# EAGLE design le_strum (EAGLE 9.6.2)
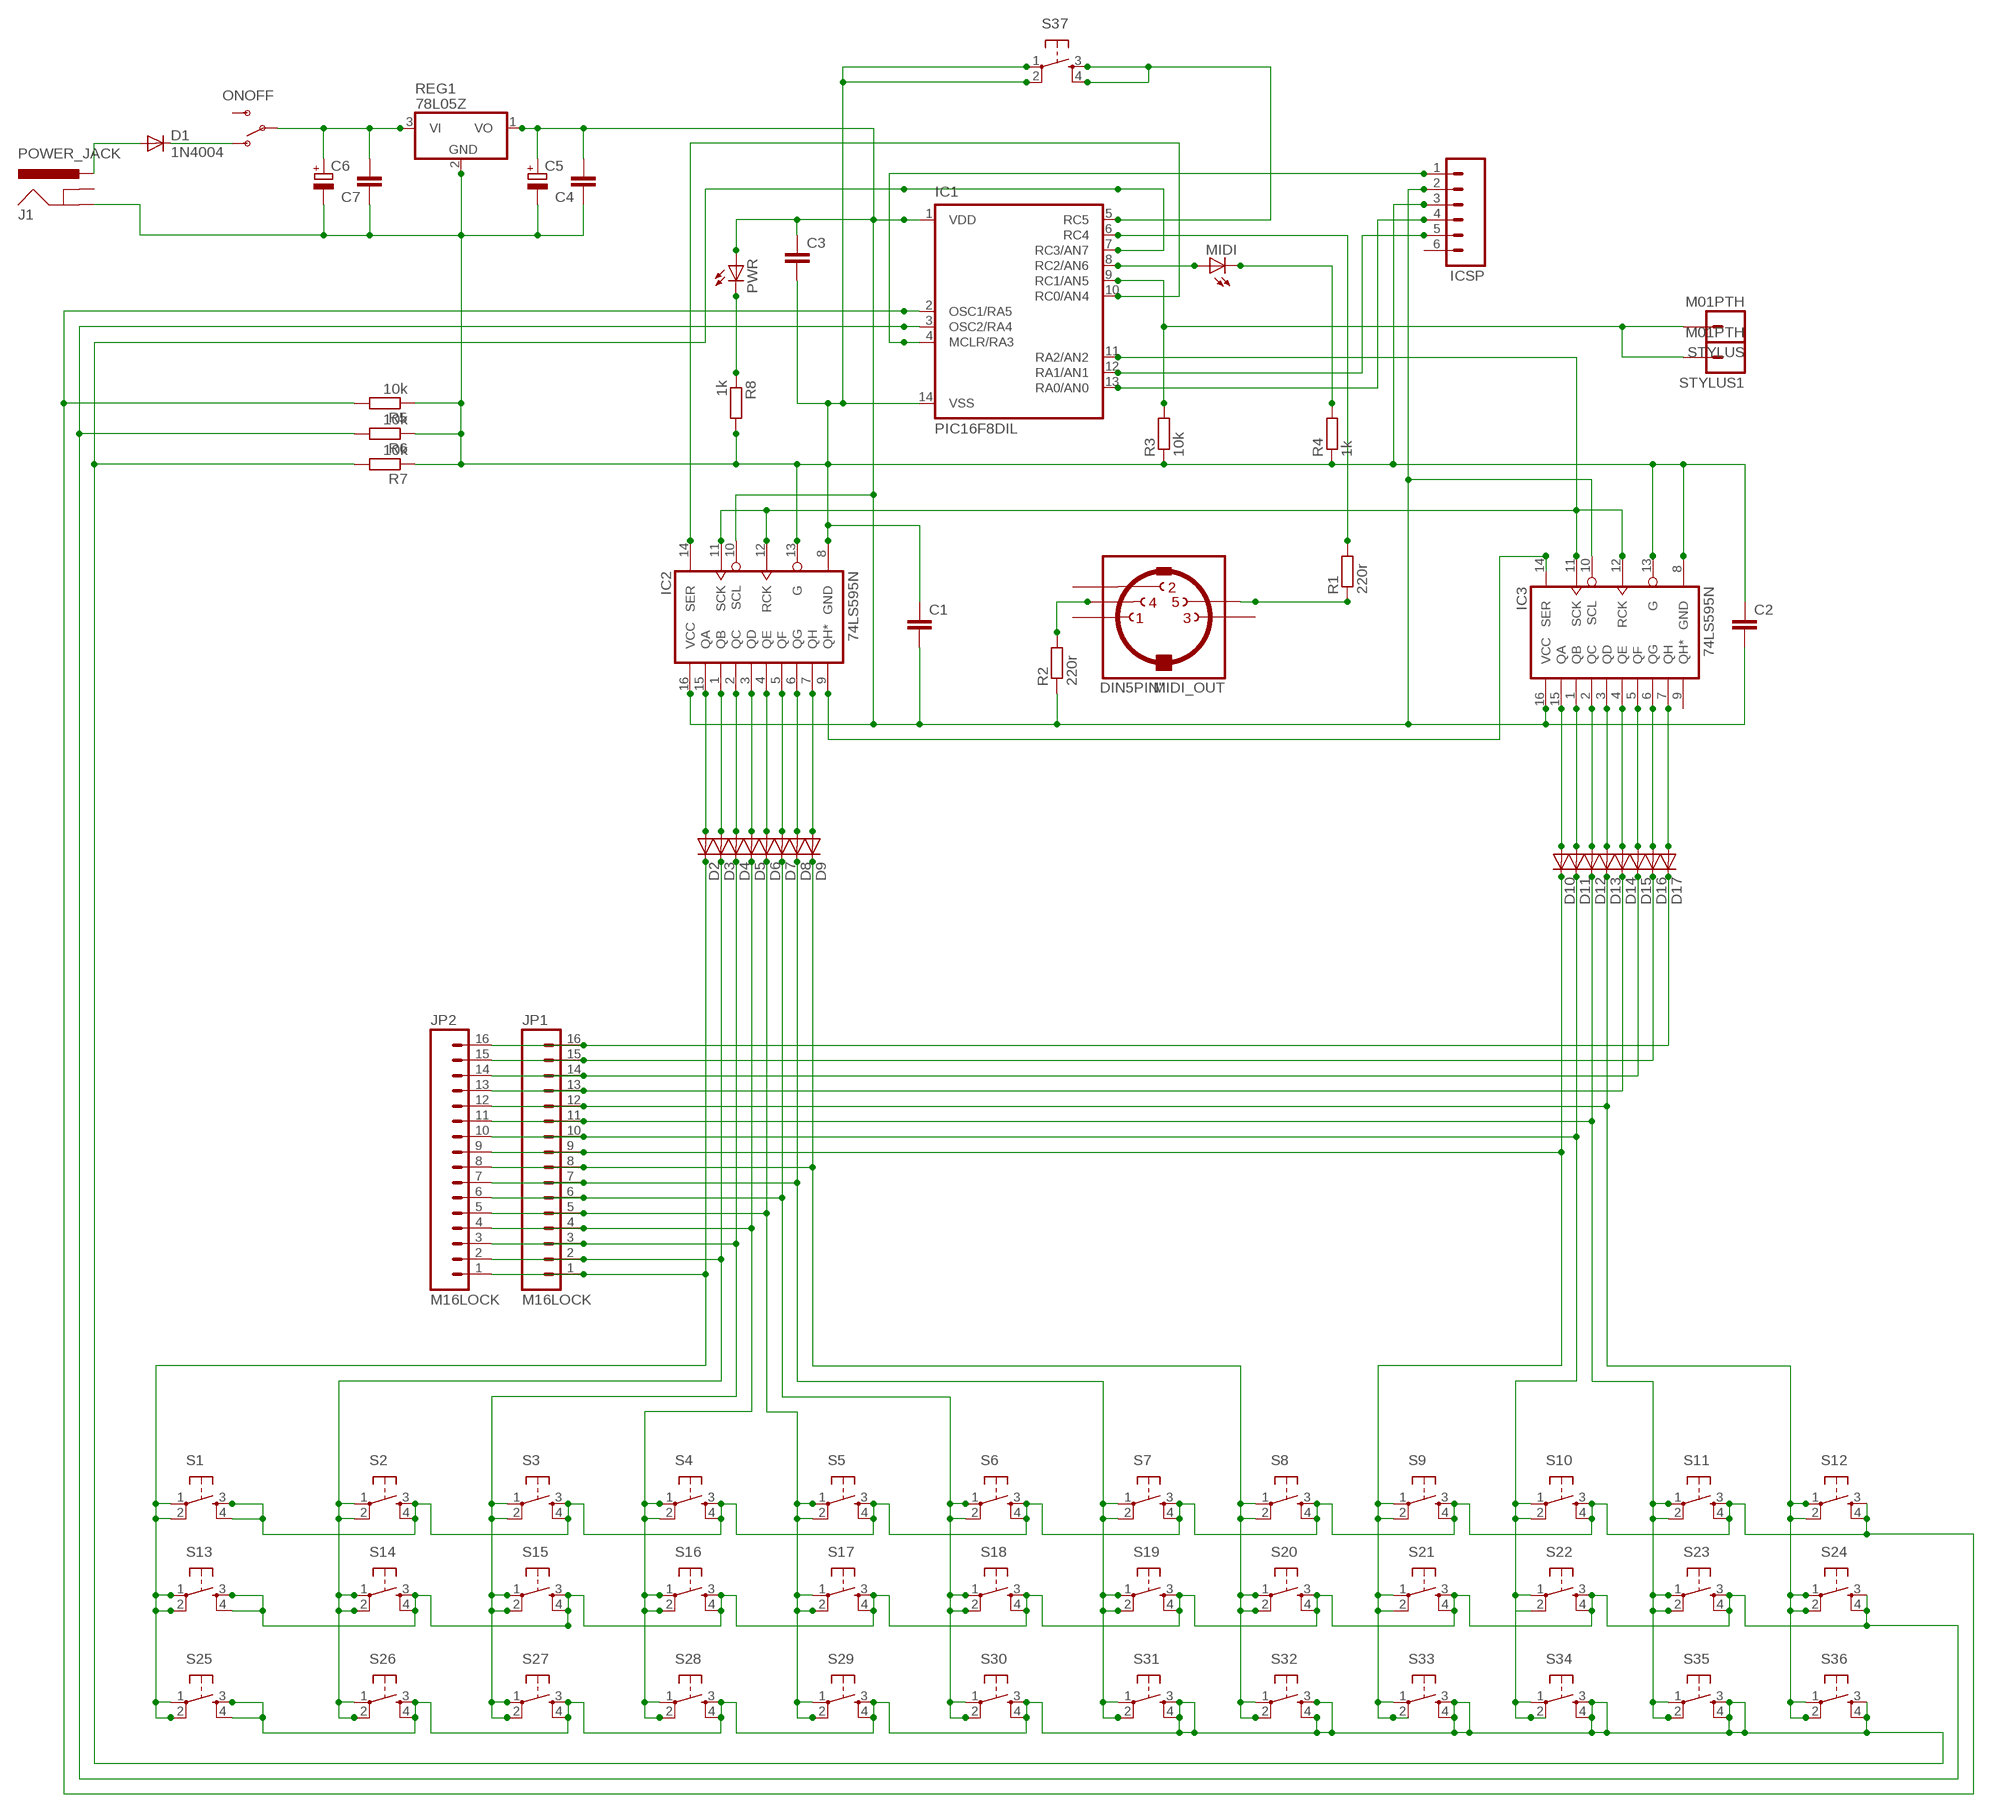
[diagram p0: schematic, sheet 1]

## Parts
C1  C-EU025-024X044  [C025-024X044]
C2  C-EU025-024X044  [C025-024X044]
C3  C-EU025-024X044  [C025-024X044]
C4  C-EU025-024X044  [C025-024X044]
C5  CPOL-EUE2-5  [E2-5]
C6  CPOL-EUE2-5  [E2-5]
C7  C-EU025-024X044  [C025-024X044]
D1  1N4004  [DO41-10]
D2  DIODE-D-5  [D-5]
D3  DIODE-D-5  [D-5]
D4  DIODE-D-5  [D-5]
D5  DIODE-D-5  [D-5]
D6  DIODE-D-5  [D-5]
D7  DIODE-D-5  [D-5]
D8  DIODE-D-5  [D-5]
D9  DIODE-D-5  [D-5]
D10  DIODE-D-5  [D-5]
D11  DIODE-D-5  [D-5]
D12  DIODE-D-5  [D-5]
D13  DIODE-D-5  [D-5]
D14  DIODE-D-5  [D-5]
D15  DIODE-D-5  [D-5]
D16  DIODE-D-5  [D-5]
D17  DIODE-D-5  [D-5]
IC1  PIC16F8DIL  [DIL14]
IC2  74LS595N  [DIL16]
IC3  74LS595N  [DIL16]
ICSP  M06SIP  [1X06]
J1  POWER_JACK  [POWER_JACK_PTH]
JP1  M16LOCK  [1X16_LOCK]
JP2  M16LOCK  [1X16_LOCK]
MIDI  LED3MM  [LED3MM]
MIDI_OUT  DIN5PIN"  [TRUCONN90]
ONOFF  SWITCH-SPSTPTH  [SWITCH-SPDT]
PWR  LED3MM  [LED3MM]
R1  220r  R-EU_0207/7  [0207/7]
R2  220r  R-EU_0207/7  [0207/7]
R3  10k  R-EU_0207/7  [0207/7]
R4  1k  R-EU_0207/7  [0207/7]
R5  10k  R-EU_0207/7  [0207/7]
R6  10k  R-EU_0207/7  [0207/7]
R7  10k  R-EU_0207/7  [0207/7]
R8  1k  R-EU_0207/7  [0207/7]
REG1  78L05Z  [TO92]
S1  TAC_SWITCHPTH  [TACTILE-PTH]
S2  TAC_SWITCHPTH  [TACTILE-PTH]
S3  TAC_SWITCHPTH  [TACTILE-PTH]
S4  TAC_SWITCHPTH  [TACTILE-PTH]
S5  TAC_SWITCHPTH  [TACTILE-PTH]
S6  TAC_SWITCHPTH  [TACTILE-PTH]
S7  TAC_SWITCHPTH  [TACTILE-PTH]
S8  TAC_SWITCHPTH  [TACTILE-PTH]
S9  TAC_SWITCHPTH  [TACTILE-PTH]
S10  TAC_SWITCHPTH  [TACTILE-PTH]
S11  TAC_SWITCHPTH  [TACTILE-PTH]
S12  TAC_SWITCHPTH  [TACTILE-PTH]
S13  TAC_SWITCHPTH  [TACTILE-PTH]
S14  TAC_SWITCHPTH  [TACTILE-PTH]
S15  TAC_SWITCHPTH  [TACTILE-PTH]
S16  TAC_SWITCHPTH  [TACTILE-PTH]
S17  TAC_SWITCHPTH  [TACTILE-PTH]
S18  TAC_SWITCHPTH  [TACTILE-PTH]
S19  TAC_SWITCHPTH  [TACTILE-PTH]
S20  TAC_SWITCHPTH  [TACTILE-PTH]
S21  TAC_SWITCHPTH  [TACTILE-PTH]
S22  TAC_SWITCHPTH  [TACTILE-PTH]
S23  TAC_SWITCHPTH  [TACTILE-PTH]
S24  TAC_SWITCHPTH  [TACTILE-PTH]
S25  TAC_SWITCHPTH  [TACTILE-PTH]
S26  TAC_SWITCHPTH  [TACTILE-PTH]
S27  TAC_SWITCHPTH  [TACTILE-PTH]
S28  TAC_SWITCHPTH  [TACTILE-PTH]
S29  TAC_SWITCHPTH  [TACTILE-PTH]
S30  TAC_SWITCHPTH  [TACTILE-PTH]
S31  TAC_SWITCHPTH  [TACTILE-PTH]
S32  TAC_SWITCHPTH  [TACTILE-PTH]
S33  TAC_SWITCHPTH  [TACTILE-PTH]
S34  TAC_SWITCHPTH  [TACTILE-PTH]
S35  TAC_SWITCHPTH  [TACTILE-PTH]
S36  TAC_SWITCHPTH  [TACTILE-PTH]
S37  TAC_SWITCHPTH  [TACTILE-PTH]
STYLUS  M01PTH  [1X01]
STYLUS1  M01PTH  [1X01]

## Nets
CARRY: IC2.9(QH*) IC3.14(SER)
CLK: IC1.11(RA2/AN2) IC2.11(SCK) IC2.12(RCK) IC3.11(SCK) IC3.12(RCK)
GND: C1.1 C2.1 C3.2 C4.1 C5.- C6.- C7.1 IC1.14(VSS) IC2.8(GND) IC2.13(G) IC3.8(GND) IC3.13(G) ICSP.3 J1.GND R3.1 R4.1 R5.1 R6.1 R7.1 R8.2 REG1.2(GND) S37.1 S37.2
LINE1: D2.C JP1.1 JP2.1 S1.1 S1.2 S13.1 S13.2 S25.1 S25.2
LINE2: D3.C JP1.2 JP2.2 S2.1 S2.2 S14.1 S14.2 S26.1 S26.2
LINE3: D4.C JP1.3 JP2.3 S3.1 S3.2 S15.1 S15.2 S27.1 S27.2
LINE4: D5.C JP1.4 JP2.4 S4.1 S4.2 S16.1 S16.2 S28.1 S28.2
LINE5: D6.C JP1.5 JP2.5 S5.1 S5.2 S17.1 S17.2 S29.1 S29.2
LINE6: D7.C JP1.6 JP2.6 S6.1 S6.2 S18.1 S18.2 S30.1 S30.2
LINE7: D8.C JP1.7 JP2.7 S7.1 S7.2 S19.1 S19.2 S31.1 S31.2
LINE8: D9.C JP1.8 JP2.8 S8.1 S8.2 S20.1 S20.2 S32.1 S32.2
LINE9: D10.C JP1.9 JP2.9 S9.1 S9.2 S21.1 S21.2 S33.1 S33.2
LINE10: D11.C JP1.10 JP2.10 S10.1 S10.2 S22.1 S22.2 S34.1 S34.2
LINE11: D12.C JP1.11 JP2.11 S11.1 S11.2 S23.1 S23.2 S35.1 S35.2
LINE12: D13.C JP1.12 JP2.12 S12.1 S12.2 S24.1 S24.2 S36.1 S36.2
LINE13: D14.C JP1.13 JP2.13
LINE14: D15.C JP1.14 JP2.14
LINE15: D16.C JP1.15 JP2.15
LINE16: D17.C JP1.16 JP2.16
N$1: IC1.2(OSC1/RA5) R5.2 S1.3 S1.4 S2.3 S2.4 S3.3 S3.4 S4.3 S4.4 S5.3 S5.4 S6.3 S6.4 S7.3 S7.4 S8.3 S8.4 S9.3 S9.4 S10.3 S10.4 S11.3 S11.4 S12.3 S12.4
N$2: D1.A J1.PWR
N$3: D1.C ONOFF.1(O)
N$4: IC1.13(RA0/AN0) ICSP.4
N$5: D2.A IC2.15(QA)
N$6: D3.A IC2.1(QB)
N$7: D4.A IC2.2(QC)
N$8: D5.A IC2.3(QD)
N$9: D6.A IC2.4(QE)
N$10: D7.A IC2.5(QF)
N$11: D8.A IC2.6(QG)
N$12: IC1.9(RC1/AN5) R3.2 STYLUS1.1 STYLUS.1
N$13: D9.A IC2.7(QH)
N$14: D10.A IC3.15(QA)
N$15: D11.A IC3.1(QB)
N$16: D12.A IC3.2(QC)
N$17: D13.A IC3.3(QD)
N$18: D14.A IC3.4(QE)
N$19: D15.A IC3.5(QF)
N$20: D16.A IC3.6(QG)
N$21: D17.A IC3.7(QH)
N$22: IC1.5(RC5) S37.3 S37.4
N$23: IC1.7(RC3/AN7) R7.2 S25.3 S25.4 S26.3 S26.4 S27.3 S27.4 S28.3 S28.4 S29.3 S29.4 S30.3 S30.4 S31.3 S31.4 S32.3 S32.4 S33.3 S33.4 S34.3 S34.4 S35.3 S35.4 S36.3 S36.4
N$34: IC1.10(RC0/AN4) IC2.14(SER)
N$35: IC1.4(MCLR/RA3) ICSP.1
N$38: IC1.8(RC2/AN6) MIDI.A
N$42: IC1.12(RA1/AN1) ICSP.5
N$44: MIDI_OUT.5 R1.1
N$46: IC1.6(RC4) R1.2
N$48: MIDI_OUT.4 R2.2
N$50: IC1.3(OSC2/RA4) R6.2 S13.3 S13.4 S14.3 S14.4 S15.3 S15.4 S16.3 S16.4 S17.3 S17.4 S18.3 S18.4 S19.3 S19.4 S20.3 S20.4 S21.3 S21.4 S22.3 S22.4 S23.3 S23.4 S24.3 S24.4
N$52: MIDI.K(C) R4.2
N$54: PWR.K(C) R8.1
N$59: C6.+ C7.2 ONOFF.2(P) REG1.3(VI)
VCC: C1.2 C2.2 C3.1 C4.2 C5.+ IC1.1(VDD) IC2.10(SCL) IC2.16(VCC) IC3.10(SCL) IC3.16(VCC) ICSP.2 PWR.A R2.1 REG1.1(VO)
Unconnected: IC3.9(QH*) ICSP.6 J1.GNDBREAK MIDI_OUT.1 MIDI_OUT.2 MIDI_OUT.3 ONOFF.3(S)

## Library data of the parts
C1-C4 C7 = rcl:C-EU: CAPACITOR, European symbol
C5 C6 = rcl:CPOL-EU: POLARIZED CAPACITOR, European symbol
D1 = diode:1N4004: DIODE general purpose rectifier, 1 A
D2-D17 = diode:DIODE-: DIODE
IC1 = pic16f6xx_14pin:PIC16F8*: MICROCONTROLLER 14-Pin, 8-Bit PIC16F8X Family - CMOS Flash Pin Compatible : 16F630, 16F676, 16F684, 16F688 Keywords: PIC16F630, PIC16F676, PIC16F684, PIC16F688
IC2 IC3 = SparkFun:74*595: 8-bit SHIFT REGISTER, output latch
ICSP = SparkFun:M06: Header 6 Standard 6-pin 0.1" header. Use with straight break away headers (SKU : PRT-00116), right angle break away headers (PRT-00553), swiss pins (PRT-00743), machine pins (PRT-00117), and female headers (PRT-00115). Molex polarized connector foot print use with SKU : PRT-08094 with associated crimp pins and housings. NOTES ON THE VARIANTS LOCK and LOCK_LONGPADS... This footprint was designed to help hold the alignment of a through-hole component (i.e. 6-pin header) while soldering it into place. You may notice that each hole has been shifted either up or down by 0.005 of an inch from it's more standard position (which is a perfectly straight line). This slight alteration caused the pins (the squares in the middle) to touch the edges of the holes. Because they are alternating, it causes a "brace" to hold the component in place. 0.005 has proven to be the perfect amount of "off-center" position when using our standard breakaway headers. Although looks a little odd when you look at the bare footprint, once you have a header in there, the alteration is very hard to notice. Also, if you push a header all the way into place, it is covered up entirely on the bottom side. This idea of altering the position of holes to aid alignment will be further integrated into the Sparkfun Library for other footprints. It can help hold any component with 3 or more connection pins.
J1 = SparkFun-Connectors:POWER_JACK: Power Jack Connector This is the standard 5.5mm barrel jack for power. The PTH is the most common, proven, reliable, footprint. The Slot footprint only works if the mill layer is transmitted to the PCB fab house so be warned. Here are the connectors we sell at SparkFun: DC Barrel Power Jack/Connector <https://www.sparkfun.com/products/119> (PRT-00119) DC Barrel Power Jack/Connector (SMD) <https://www.sparkfun.com/products/12748> (PRT-12748) DC Barrel Jack Adapter - Breadboard Compatible <https://www.sparkfun.com/products/10811> (PRT-10811) It is used on this SparkFun product (and many, many others): SparkFun RedBoard - Programmed with Arduino <https://www.sparkfun.com/products/12757> (DEV-12757) Also, if you need a mating power supply or connector, please check these out: Wall Adapter Power Supply - 9VDC 650mA <https://www.sparkfun.com/products/298> (TOL-00298) DC Barrel Jack Adapter - Male <https://www.sparkfun.com/products/10287> (PRT-10287); PROD_ID: CONN-08197
JP1 JP2 = SparkFun:M16
MIDI PWR = led:LED: LED OSRAM: - CHIPLED LG R971, LG N971, LY N971, LG Q971, LY Q971, LO R971, LY R971 LH N974, LH R974 LS Q976, LO Q976, LY Q976 LO Q996 - Hyper CHIPLED LW Q18S LB Q993, LB Q99A, LB R99A - SideLED LS A670, LO A670, LY A670, LG A670, LP A670 LB A673, LV A673, LT A673, LW A673 LH A674 LY A675 LS A676, LA A676, LO A676, LY A676, LW A676 LS A679, LY A679, LG A679 - Hyper Micro SIDELED® LS Y876, LA Y876, LO Y876, LY Y876 LT Y87S - SmartLED LW L88C, LW L88S LB L89C, LB L89S, LG L890 LS L89K, LO L89K, LY L89K LS L896, LA L896, LO L896, LY L896 - TOPLED LS T670, LO T670, LY T670, LG T670, LP T670 LSG T670, LSP T670, LSY T670, LOP T670, LYG T670 LG T671, LOG T671, LSG T671 LB T673, LV T673, LT T673, LW T673 LH T674 LS T676, LA T676, LO T676, LY T676, LB T676, LH T676, LSB T676, LW T676 LB T67C, LV T67C, LT T67C, LS T67K, LO T67K, LY T67K, LW E67C LS E67B, LA E67B, LO E67B, LY E67B, LB E67C, LV E67C, LT E67C LW T67C LS T679, LY T679, LG T679 LS T770, LO T770, LY T770, LG T770, LP T770 LB T773, LV T773, LT T773, LW T773 LH T774 LS E675, LA E675, LY E675, LS T675 LS T776, LA T776, LO T776, LY T776, LB T776 LHGB T686 LT T68C, LB T68C - Hyper Mini TOPLED® LB M676 - Mini TOPLED Santana® LG M470 LS M47K, LO M47K, LY M47K Source: http://www.osram.convergy.de LUXEON: - LUMILED® LXK2-PW12-R00, LXK2-PW12-S00, LXK2-PW14-U00, LXK2-PW14-V00 LXK2-PM12-R00, LXK2-PM12-S00, LXK2-PM14-U00 LXK2-PE12-Q00, LXK2-PE12-R00, LXK2-PE12-S00, LXK2-PE14-T00, LXK2-PE14-U00 LXK2-PB12-K00, LXK2-PB12-L00, LXK2-PB12-M00, LXK2-PB14-N00, LXK2-PB14-P00, LXK2-PB14-Q00 LXK2-PR12-L00, LXK2-PR12-M00, LXK2-PR14-Q00, LXK2-PR14-R00 LXK2-PD12-Q00, LXK2-PD12-R00, LXK2-PD12-S00 LXK2-PH12-R00, LXK2-PH12-S00 LXK2-PL12-P00, LXK2-PL12-Q00, LXK2-PL12-R00 Source: www.luxeon.com KINGBRIGHT: KA-3528ASYC Source: www.kingbright.com
MIDI_OUT = jasons_stuff:DIN5PIN: Female CONNECTOR 5 pins 90 deg. with shield, horizontal (DIN 41524)
ONOFF = SparkFun:SWITCH-SPST: SPST Switch Simple slide switch. Spark Fun Electronics SKU : COM-00102
R1-R8 = resistor:R-EU_: RESISTOR, European symbol
REG1 = adafruit:78*: Positive VOLTAGE REGULATOR Added bigger pads to the TO-92 package
S1-S37 = SparkFun:TAC_SWITCH: Momentary Switch Button commonly used for reset or general input. Spark Fun Electronics SKU : COM-00097
STYLUS STYLUS1 = SparkFun:M01: Header 1 Standard 1-pin 0.1" header. Use with straight break away headers (SKU : PRT-00116), right angle break away headers (PRT-00553), swiss pins (PRT-00743), machine pins (PRT-00117), and female headers (PRT-00115).

## Board
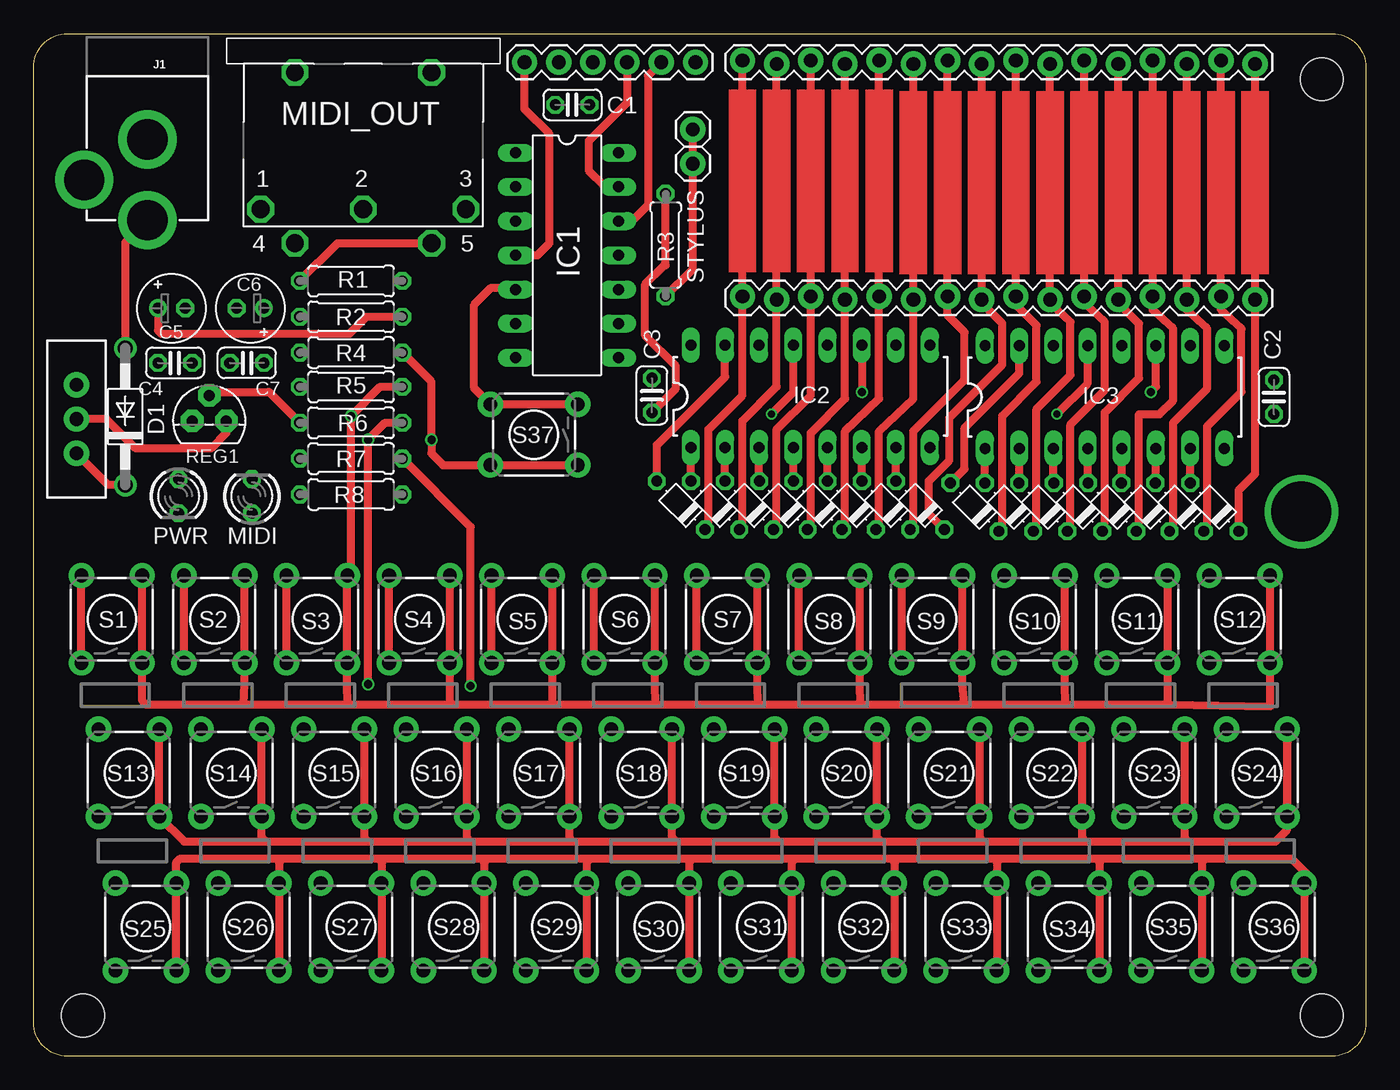
[diagram p1: board, top side]
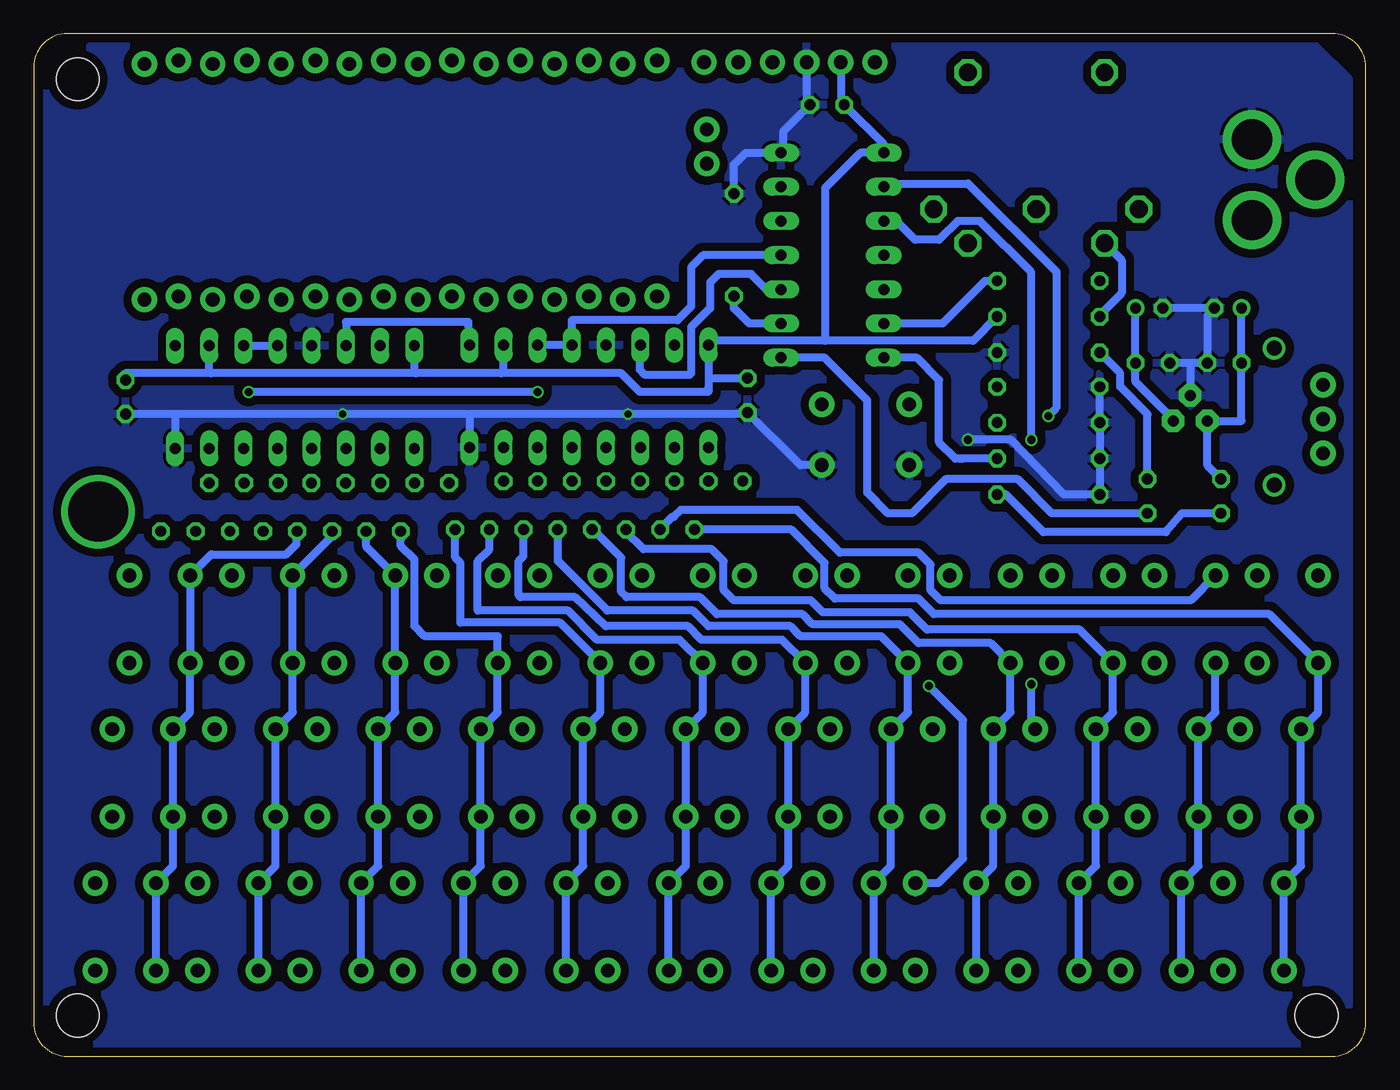
[diagram p2: board, bottom side, seen from below]

Size 99 x 76 mm. Coordinates in mm from the lower left corner, seen from the top.
Outline: 96.5,0 2.5,0 arc-90 0,2.5 0,73.5 arc-90 2.5,76 96.5,76 arc-90 99,73.5 99,2.5 arc-90 96.5,0
Copper layers (1*16): Top 0.035mm / dielectric 1.5mm / Bottom 0.035mm
Design rules "ITEADstudio_DRC": minimum track width 6mil, minimum drill 12mil, track to track 6mil, track to pad 6mil, pad to pad 6mil, via to via 6mil, smd to smd 0mil, copper to edge 10mil, drill to drill 10mil, minimum pad ring 10mil, minimum via ring 6mil, stop-mask expansion 2mil, vias tented up to drill 100mil, thermal gap 10mil
Holes 3.2 mm at 95.73,72.61 3.65,3.02 95.73,3.02

### Footprints (pad centres in the part's own frame; a part is rotated, then mirrored left to right if it is on the bottom)
C025-024X044 = drill 0.813 octagon: 1 -1.27,0; 2 1.27,0
E2-5 = drill 0.813 pad 1.27: + -1.016,0 | drill 0.813 pad 1.27 octagon: - 1.016,0
DO41-10 = drill 1.118: A 5.08,0; C -5.08,0
D-5 = drill 0.813 octagon: A 2.54,0; C -2.54,0
DIL14 = drill 0.813 long: 1 -10.16,-3.81; 2 -7.62,-3.81; 3 -5.08,-3.81; 4 -2.54,-3.81; 5 0,-3.81; 6 2.54,-3.81; 7 5.08,-3.81; 8 5.08,3.81; 9 2.54,3.81; 10 0,3.81; 11 -2.54,3.81; 12 -5.08,3.81; 13 -7.62,3.81; 14 -10.16,3.81
DIL16 = drill 0.813 long: 1 -8.89,-3.81; 2 -6.35,-3.81; 3 -3.81,-3.81; 4 -1.27,-3.81; 5 1.27,-3.81; 6 3.81,-3.81; 7 6.35,-3.81; 8 8.89,-3.81; 9 8.89,3.81; 10 6.35,3.81; 11 3.81,3.81; 12 1.27,3.81; 13 -1.27,3.81; 14 -3.81,3.81; 15 -6.35,3.81; 16 -8.89,3.81
1X06 = drill 1.016 pad 1.88: 1 0,0; 2 2.54,0; 3 5.08,0; 4 7.62,0; 5 10.16,0; 6 12.7,0
POWER_JACK_PTH = drill 2.997 pad 4.318: GND 0,7.7; GNDBREAK 4.7,10.7; PWR 0,13.7
1X16_LOCK = drill 1.016 pad 1.88: 1 0,0.127; 2 2.54,-0.127; 3 5.08,0.127; 4 7.62,-0.127; 5 10.16,0.127; 6 12.7,-0.127; 7 15.24,0.127; 8 17.78,-0.127; 9 20.32,0.127; 10 22.86,-0.127; 11 25.4,0.127; 12 27.94,-0.127; 13 30.48,0.127; 14 33.02,-0.127; 15 35.56,0.127; 16 38.1,-0.127
LED3MM = drill 0.813 octagon: A -1.27,0; K 1.27,0
TRUCONN90 = drill 1.321 octagon: 1 7.62,5.08; 2 0,5.08; 3 -7.62,5.08; 4 5.08,7.62; 5 -5.08,7.62; NC -5.08,-5.08; NC@ 5.08,-5.08
SWITCH-SPDT = drill 1.016 pad 1.88: 1 0,2.54; 2 0,0; 3 0,-2.54
0207/7 = drill 0.813 octagon: 1 -3.81,0; 2 3.81,0
TO92 = drill 0.813 pad 1.676 octagon: 1 -1.27,0; 2 0,1.905; 3 1.27,0
TACTILE-PTH = drill 1.016 pad 1.88: 1 -3.251,2.261; 2 3.251,2.261; 3 -3.251,-2.261; 4 3.251,-2.261
1X01 = drill 1.016 pad 1.88: 1 0,0

### Placement (x,y rotation side)
C1  40.04,70.71 180 top
C2  92.17,48.99 90 top
C3  45.94,49.12 270 top
C4  10.51,51.53 180 top
C5  10.26,55.59 0 top
C6  16.1,55.59 180 top
C7  15.84,51.53 0 top
D1  6.81,47.53 90 top
D2  48.1,40.94 135 top
D3  50.64,40.94 135 top
D4  53.18,40.94 135 top
D5  55.72,40.94 135 top
D6  58.26,40.94 135 top
D7  60.8,40.94 135 top
D8  63.34,40.94 135 top
D9  65.88,40.94 135 top
D10  69.92,40.81 135 top
D11  72.48,40.81 135 top
D12  75.03,40.81 135 top
D13  77.62,40.81 135 top
D14  80.16,40.81 135 top
D15  82.62,40.81 135 top
D16  85.16,40.81 135 top
D17  87.75,40.81 135 top
IC1  39.64,56.99 270 top
IC2  57.73,49.04 0 top
IC3  79.6,48.99 0 top
ICSP  36.48,73.88 0 top
J1  8.46,75.83 180 top
JP1  52.67,73.88 0 top
JP2  52.67,56.36 0 top
MIDI  16.22,41.62 90 top
MIDI_OUT  24.49,68.04 180 top
ONOFF  3.17,47.36 180 top
PWR  10.76,41.62 270 top
R1  23.59,57.63 0 top
R2  23.59,54.96 180 top
R3  46.96,60.29 270 top
R4  23.59,52.29 180 top
R5  23.59,49.75 0 top
R6  23.59,47.09 0 top
R7  23.59,44.42 0 top
R8  23.59,41.75 180 top
REG1  13.05,47.21 0 top
S1  5.81,32.48 90 top
S2  13.43,32.48 90 top
S3  21.05,32.48 90 top
S4  28.67,32.48 90 top
S5  36.29,32.48 90 top
S6  43.91,32.48 90 top
S7  51.53,32.48 90 top
S8  59.15,32.48 90 top
S9  66.77,32.48 90 top
S10  74.39,32.48 90 top
S11  82.01,32.48 90 top
S12  89.63,32.48 90 top
S13  7.08,21.05 90 top
S14  14.7,21.05 90 top
S15  22.32,21.05 90 top
S16  29.94,21.05 90 top
S17  37.56,21.05 90 top
S18  45.18,21.05 90 top
S19  52.8,21.05 90 top
S20  60.42,21.05 90 top
S21  68.04,21.05 90 top
S22  75.66,21.05 90 top
S23  83.28,21.05 90 top
S24  90.9,21.05 90 top
S25  8.35,9.62 90 top
S26  15.97,9.62 90 top
S27  23.59,9.62 90 top
S28  31.21,9.62 90 top
S29  38.83,9.62 90 top
S30  46.45,9.62 90 top
S31  54.07,9.62 90 top
S32  61.69,9.62 90 top
S33  69.31,9.62 90 top
S34  76.93,9.62 90 top
S35  84.55,9.62 90 top
S36  92.17,9.62 90 top
S37  37.18,46.2 180 top
STYLUS  48.99,68.88 0 top
STYLUS1  48.99,66.34 0 top

### Tracks (layer width: path | path; a pad name or v marks a point on that pad's centre or on a via)
CARRY
  Bottom 0.61: IC3.14 75.79,54.58 66.69,54.58 IC2.9
CLK  (via drill 0.6)
  Top 0.61: IC2.11 61.54,49.4 v61.56,49.37 | v83.03,49.37 83.41,49.75 IC3.11
  Bottom 0.61: IC2.11 IC2.12 59.02,52.88 59.02,54.7 51.15,54.7 50.13,55.72 50.13,58.64 49.24,59.53 IC1.11 | IC3.11 IC3.12 | v61.56,49.37 v83.03,49.37
GND  (via drill 0.5, 0.6)
  Top 0.61: IC3.13 78.33,50.01 v76.04,47.72 | IC2.13 56.46,49.35 v54.83,47.72 | S37.1 S37.2 30.42,43.94 29.56,44.8 v29.56,45.81 29.56,50.13 R4.1 | R3.1 46.96,58.77 46.83,58.77 45.43,57.37 45.43,53.56 47.72,51.28 47.72,49.62 C3.2 | R6.1 17.49,49.37 13.3,49.37 REG1.2
  Bottom 0.61: 66.62,47.57 IC2.8 | 66.62,47.57 66.77,47.72 v76.04,47.72 88.36,47.72 | 66.62,47.57 66.62,47.7 66.64,47.72 v54.83,47.72 46.07,47.72 C3.2 42.03,43.94 S37.1 | 88.36,47.72 C2.1 | IC3.8 88.49,47.59 88.36,47.72 | ICSP.3 41.56,70.96 C1.1 43.31,68.71 43.31,67.15 IC1.14 46.07,67.15 46.96,66.26 R3.1 | C6.- C5.- 11.78,55.09 C4.1 12.92,51.53 | 12.92,51.53 C7.1 | R6.1 R7.1 R8.2 | R6.1 R8.2 | R8.2 22.45,41.75 26.38,45.81 v29.56,45.81 | REG1.2 13.05,51.4 12.92,51.53 | R6.1 R5.1
  pour Bottom (isolate 0.61): 1.24,70.33 1.24,72.61 3.78,75.15 94.71,75.15 98.01,71.85 98.01,3.78 94.96,0.73 4.29,0.73 1.24,3.78
LINE1
  Top 0.61: S1.1 S1.2 | JP1.1 JP2.1 52.67,49.12 50.13,46.58 50.13,39.38 D2.C
  Bottom 0.61: S25.1 S25.2 4.82,14.14 S13.1 S13.2 3.55,25.57 S1.1 7.18,32.86 32.1,32.86 33.24,34 39.47,34 40.23,34.77 40.23,36.67 42.7,39.14 D2.C
LINE2
  Top 0.61: S2.1 S2.2 | JP1.2 JP2.2 55.21,49.75 52.67,47.21 52.67,39.38 D3.C
  Bottom 0.61: S2.1 11.17,25.57 S14.2 S14.1 12.44,14.14 S26.2 S26.1 | D3.C 52.44,39.19 51.53,40.1 51.4,40.1 50.9,40.61 42.26,40.61 39.08,37.43 33.24,37.43 32.35,36.54 32.35,34.64 31.59,33.88 13.02,33.88 S2.2
LINE3
  Top 0.61: S3.1 S3.2 | JP1.3 JP2.3 57.75,49.12 55.21,46.58 55.21,39.38 D4.C
  Bottom 0.61: S27.1 S27.2 20.06,14.14 S15.1 S15.2 18.79,25.57 S3.1 21.28,31.72 32.61,31.72 33.88,32.99 40.35,32.99 41.24,33.88 46.96,33.88 47.72,34.64 47.72,36.8 48.61,37.69 53.69,37.69 54.98,38.98 D4.C
LINE4
  Top 0.61: S4.1 S4.2 | JP1.4 JP2.4 60.29,48.86 57.75,46.32 57.75,39.38 D5.C
  Bottom 0.61: S28.1 S28.2 27.68,14.14 S16.1 S16.2 26.41,25.57 S4.1 27.88,30.7 33.24,30.7 34.64,32.1 41.12,32.1 41.88,32.86 48.23,32.86 49.5,34.13 54.96,34.13 55.34,34.51 55.34,37.05 57.43,39.14 D5.C
LINE5
  Top 0.61: S5.2 S5.1 34.03,28.67 | JP1.5 JP2.5 62.83,48.86 60.29,46.45 60.29,39.51 D6.C
  Bottom 0.61: S29.1 S29.2 35.3,14.14 S17.1 S17.2 34.03,25.57 S5.1 36.01,31.21 42.01,31.21 42.77,31.97 48.86,31.97 50.01,33.11 56.36,33.11 60.04,36.8 60.04,39.12 D6.C
LINE6
  Top 0.61: S6.1 S6.2 | JP1.6 JP2.6 65.37,48.86 62.83,46.45 62.83,39.51 D7.C
  Bottom 0.61: S30.1 S30.2 42.92,14.14 S18.1 S18.2 41.65,25.57 S6.1 43.38,30.96 49.37,30.96 50.39,31.97 56.48,31.97 58.77,34.13 62.83,34.13 62.96,34.26 62.96,36.8 62.6,37.16 D7.C
LINE7
  Top 0.61: S7.1 S7.2 | JP1.7 JP2.7 67.91,55.09 69.18,53.82 69.18,50.26 65.37,46.45 65.37,39.51 D8.C
  Bottom 0.61: S31.1 S31.2 50.54,14.14 S19.1 S19.2 49.27,25.57 S7.1 51,30.96 57.12,30.96 59.28,33.11 66.01,33.11 66.01,36.8 65.14,37.67 D8.C
LINE8
  Top 0.61: JP1.8 JP2.8 70.45,55.98 71.98,54.45 71.98,51.4 68.04,47.47 68.04,44.29 66.52,42.77 66.52,40.3 D9.C | S8.1 S8.2
  Bottom 0.61: S32.1 S32.2 58.16,14.14 S20.1 S20.2 56.89,25.57 S8.1 59.89,32.23 67.28,32.23 67.28,36.67 67.68,37.07 D9.C
LINE9
  Top 0.61: JP1.9 JP2.9 72.99,55.85 74.52,54.32 74.52,50.13 71.98,47.59 71.98,39.15 D10.C | S9.1 S9.2
  Bottom 0.61: S33.1 S33.2 65.78,14.14 S21.1 S21.2 64.51,25.57 S9.1 64.51,31.21 69.94,31.21 70.71,31.97 70.71,36.92 71.72,37.93 D10.C
LINE10
  Top 0.61: JP1.10 JP2.10 75.53,55.98 77.06,54.58 77.06,50.64 74.52,48.1 74.52,39.12 D11.C
  Bottom 0.61: S34.1 S34.2 73.4,14.14 S22.1 S22.2 72.13,25.57 S10.1 S10.2 74.28,37.88 D11.C
LINE11
  Top 0.61: JP1.11 JP2.11 78.07,55.98 79.6,54.58 79.6,49.5 77.06,46.96 77.06,39.25 D12.C
  Bottom 0.61: S35.1 S35.2 81.02,14.14 S23.1 S23.2 79.75,25.57 S11.1 S11.2 76.82,38.66 D12.C
LINE12
  Top 0.61: JP1.12 JP2.12 80.61,55.98 82.14,54.45 82.14,50.39 79.6,47.85 79.6,39.2 D13.C
  Bottom 0.61: S12.1 87.09,29.51 | S12.1 87.34,29.25 87.34,35.71 S12.2 85.8,37.31 80.23,37.31 79.47,38.07 79.47,38.96 D13.C | S12.1 87.37,25.57 S24.2 S24.1 88.64,14.14 S36.2 S36.1
LINE13
  Top 0.61: JP1.13 JP2.13 83.15,55.47 84.68,54.07 84.68,48.74 83.66,47.72 82.14,47.72 82.14,39.2 D14.C
LINE14
  Top 0.61: JP1.14 JP2.14 85.69,55.47 87.22,54.07 87.22,49.62 84.68,47.09 84.68,39.28 D15.C
LINE15
  Top 0.61: JP1.15 JP2.15 88.23,55.47 89.76,54.07 89.76,49.37 87.22,46.83 87.22,39.15 D16.C
LINE16
  Top 0.61: JP1.16 JP2.16 90.77,43.29 89.55,42.06 D17.C
N$1  (via drill 0.6)
  Top 0.61: 15.59,26.13 8.35,26.13 8.07,26.41 S1.3 S1.4 | 15.59,26.13 23.34,26.13 | 23.34,26.13 30.96,26.13 | 30.96,26.13 38.58,26.13 | 38.58,26.13 46.2,26.13 | 46.2,26.13 53.82,26.13 | 53.82,26.13 61.44,26.13 | 61.44,26.13 69.18,26.13 | 69.18,26.13 76.68,26.13 | 76.68,26.13 84.3,26.13 | 84.3,26.13 91.92,26 91.92,29.08 S12.3 S12.4 | S11.4 S11.3 84.27,27.68 84.3,26.13 | S10.4 S10.3 76.65,27.68 76.68,26.13 | S9.4 S9.3 69.03,27.68 69.18,26.13 | S8.4 S8.3 61.41,27.68 61.44,26.13 | S7.4 S7.3 53.79,27.68 53.82,26.13 | S6.4 S6.3 46.17,27.68 46.2,26.13 | S5.4 S5.3 38.55,27.68 38.58,26.13 | S4.4 S4.3 30.93,27.68 30.96,26.13 | S2.4 S2.3 15.69,27.68 15.59,26.13 | 23.34,26.13 23.31,27.68 S3.3 S3.4 23.59,36.01 v23.59,47.59 25.75,49.75 R5.2
  Bottom 0.61: IC1.2 35.58,64.87 29.56,64.87 22.97,58.28 23,58.25 23,48.18 v23.59,47.59
N$2
  Top 0.61: J1.PWR 6.81,60.48 D1.A
N$3
  Top 0.61: D1.C 5.54,42.45 ONOFF.1
N$4
  Top 0.61: ICSP.4 44.1,70.88 41.24,68.03 41.24,65.82 42.45,64.61 IC1.13
N$5
  Top 0.61: IC2.15 51.38,50.49 46.32,45.43 46.32,42.75 D2.A
N$6
  Top 0.61: IC2.1 48.84,42.74 D3.A
N$7
  Top 0.61: IC2.2 51.38,42.74 D4.A
N$8
  Top 0.61: IC2.3 53.92,42.74 D5.A
N$9
  Top 0.61: IC2.4 56.46,42.74 D6.A
N$10
  Top 0.61: D7.A IC2.5
N$11
  Top 0.61: D8.A IC2.6
N$12
  Top 0.61: STYLUS.1 STYLUS1.1 48.99,58.52 R3.2
  Bottom 0.61: IC1.9 45.81,54.45 46.96,55.59 R3.2
N$13
  Top 0.61: D9.A IC2.7
N$14
  Top 0.61: D10.A 68.13,42.61 69.18,43.66 69.18,46.7 73.25,50.77 IC3.15
N$15
  Top 0.61: IC3.1 70.71,42.62 D11.A
N$16
  Top 0.61: IC3.2 73.25,42.62 D12.A
N$17
  Top 0.61: IC3.3 75.79,42.64 D13.A
N$18
  Top 0.61: IC3.4 78.33,42.64 D14.A
N$19
  Top 0.61: IC3.5 80.87,42.65 D15.A
N$20
  Top 0.61: IC3.6 83.41,42.65 D16.A
N$21
  Top 0.61: IC3.7 D17.A
N$22
  Top 0.61: S37.3 S37.4 32.73,49.65 32.73,55.85 34,57.12 35.7,57.12 IC1.5
N$23  (via drill 0.6)
  Top 0.61: S25.3 S25.4 10.61,14.42 10.89,14.7 18.51,14.7 | S26.3 S26.4 18.23,14.42 18.51,14.7 | S27.3 S27.4 25.85,14.42 26.13,14.7 | S28.3 S28.4 33.47,14.42 33.75,14.7 | S29.3 S29.4 41.09,14.42 41.37,14.7 | S30.3 S30.4 48.71,14.42 48.99,14.7 | S31.3 S31.4 56.33,14.42 56.61,14.7 | S32.3 S32.4 63.95,14.42 64.23,14.7 | S33.3 S33.4 71.57,14.42 71.85,14.7 | S34.3 S34.4 79.19,14.42 79.47,14.7 | S35.3 S35.4 86.81,14.42 87.09,14.7 | S36.3 S36.4 94.71,13.15 94.71,13.43 93.44,14.7 87.09,14.7 | 18.51,14.7 26.13,14.7 | 26.13,14.7 33.75,14.7 | 33.75,14.7 41.37,14.7 | 41.37,14.7 48.99,14.7 | 48.99,14.7 56.61,14.7 | 56.61,14.7 64.23,14.7 | 64.23,14.7 71.85,14.7 | 71.85,14.7 79.47,14.7 | 79.47,14.7 87.09,14.7 | v32.48,27.53 32.48,39.34 R7.2
  Bottom 0.61: S28.4 33.47,12.16 | S28.4 33.47,13.43 | S28.4 31.77,12.87 29.94,14.7 29.94,24.99 v32.48,27.53 | R7.2 30,44.42 30.19,44.42 30.51,44.42 31.72,45.63 31.72,50.26 33.37,51.91 IC1.7
N$24  (via drill 4.45)
  other vias: 94.2,40.48
N$34
  Bottom 0.61: IC2.14 53.94,52.83 53.94,51.02 53.56,50.64 50.26,50.64 50.13,50.77 50.13,54.2 48.74,55.59 48.74,57.5 48.1,58.13 45.69,58.13 44.55,56.99 IC1.10
N$35
  Top 0.61: IC1.4 37.43,59.53 38.32,60.42 38.32,68.55 36.48,70.39 ICSP.1
N$38
  Bottom 0.61: MIDI.A 23.34,40.35 25.88,42.89 31.21,42.89 33.75,40.35 35.53,40.35 37.05,41.88 37.05,48.74 40.23,51.91 IC1.8
N$42
  Top 0.61: IC1.12 44.45,62.07 45.64,63.26 45.64,72.88 ICSP.5
N$44
  Top 0.61: R1.1 22.57,60.42 MIDI_OUT.5
N$46
  Bottom 0.61: R1.2 28.29,57.63 31.46,54.45 IC1.6
N$48
  Bottom 0.61: R2.2 19.78,55.09 18.14,56.72 18.14,59.15 MIDI_OUT.4
N$50  (via drill 0.6)
  Top 0.61: S13.4 S13.3 11.17,15.97 17.24,15.97 | S14.4 S14.3 16.96,16.25 17.24,15.97 | S15.4 S15.3 24.58,16.25 24.86,15.97 | S16.4 S16.3 32.2,16.25 32.48,15.97 | S17.4 S17.3 39.82,16.25 40.1,15.97 | S18.4 S18.3 47.44,16.25 47.72,15.97 | S19.4 S19.3 55.06,16.25 55.34,15.97 | S20.4 S20.3 62.68,16.25 62.96,15.97 | S21.4 S21.3 70.3,16.25 70.58,15.97 | S22.4 S22.3 77.92,16.25 78.2,15.97 | S23.4 S23.3 85.54,16.25 85.82,15.97 | S24.3 S24.4 93.16,16.83 92.3,15.97 85.82,15.97 | 17.24,15.97 24.86,15.97 | 24.86,15.97 32.48,15.97 | 32.48,15.97 40.1,15.97 | 40.1,15.97 47.72,15.97 | 47.72,15.97 55.34,15.97 | 55.34,15.97 62.96,15.97 | 62.96,15.97 70.58,15.97 | 70.58,15.97 78.2,15.97 | 78.2,15.97 85.82,15.97 | v24.86,27.65 v24.86,45.81 26.13,47.09 R6.2
  Bottom 0.61: 24.86,23.87 24.58,23.59 S15.4 24.86,24.58 v24.86,27.65 | v24.86,45.81 24.86,58.26 28.67,62.07 30.32,62.07 31.72,60.67 33.5,60.67 34.89,62.07 IC1.3
N$52
  Bottom 0.61: MIDI.K 16.22,47.72 18.26,49.75 18.26,50.77 R4.2
N$54
  Bottom 0.61: R8.1 26.77,41.75 23.97,38.96 14.86,38.96 13.67,40.35 PWR.K
N$59
  Top 0.61: REG1.3 14.32,46.32 13.18,45.18 7.59,45.18 5.41,47.36 ONOFF.2
  Bottom 0.61: C6.+ C7.2 17.11,50.13 14.7,47.72 14.7,47.59 REG1.3
VCC
  Top 0.61: R2.1 24.73,54.96 23.46,53.69 9.49,53.69 9.24,53.94 C5.+
  Bottom 0.61: 92.55,50.39 C2.2 92.17,50.77 85.82,50.77 | IC2.16 48.84,50.39 | 48.84,50.39 48.84,49.65 49.12,49.37 | 49.12,49.37 48.86,49.37 48.86,52.85 IC2.16 | 49.12,49.37 53.94,49.37 55.34,50.77 64.23,50.77 | 64.23,50.77 70.58,50.77 | 70.58,50.77 85.82,50.77 | IC2.10 64.08,50.92 64.23,50.77 | IC3.16 70.71,50.9 70.58,50.77 | IC3.10 85.95,50.9 85.82,50.77 | ICSP.2 39.02,70.96 C1.2 35.83,67.77 IC1.1 37.56,67.15 40.16,64.55 40.16,53.18 | 40.16,53.18 29.18,53.18 R2.1 | C5.+ C4.2 9.24,47.21 REG1.1 11.78,43.91 PWR.A | 48.84,50.39 C3.1 | 40.16,53.18 48.51,53.18 IC2.16
(copper drawn outside any net)
  shapes: Top area x16

### Text on the board
tDocu: 1 | 9V | central / positive | D2- | D17 | ON | mode | g | a | b | c | d | e | f | maj | min | hotchk155 | 7th | midi strum controller rev 3